# EAGLE design lyte-byte-pcb (EAGLE 7.4.0)
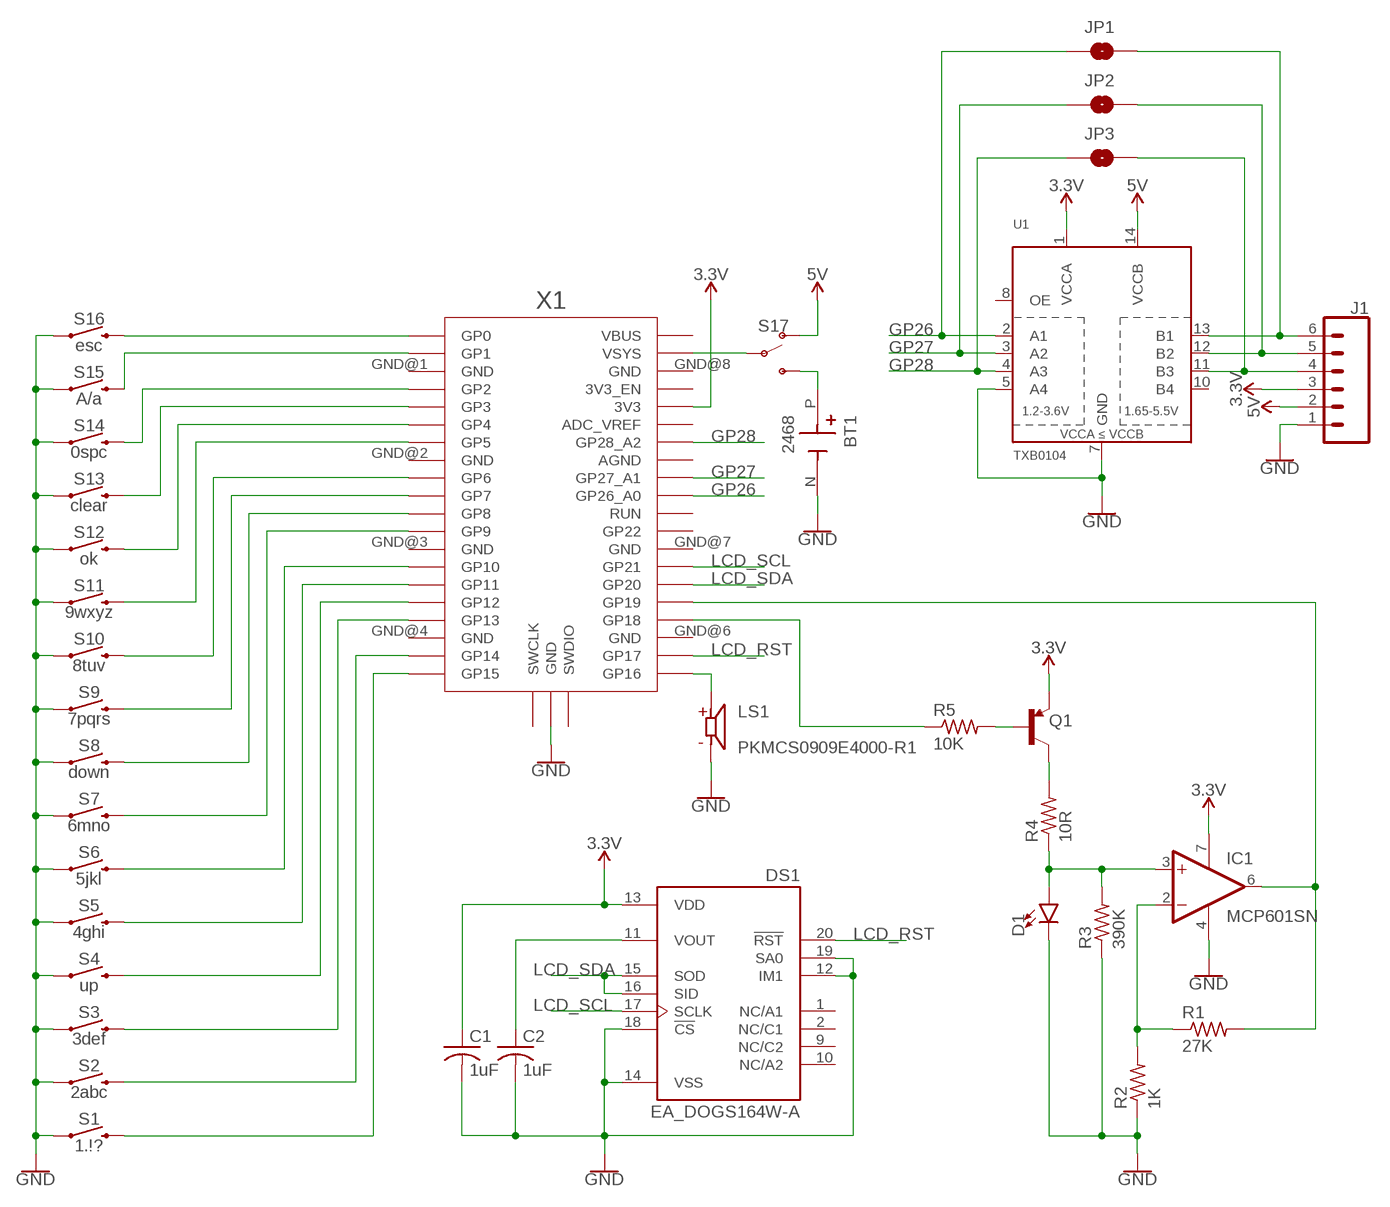
[diagram p0: schematic, sheet 1]

## Parts
BT1  2468  [BAT_2468]
C1  1uF  C-USC1206  [C1206]
C2  1uF  C-USC1206  [C1206]
D1  LED5MM  [LED_5MM]
DS1  EA_DOGS164W-A  [LCD_EA_DOGS164W-A]
IC1  MCP601SN  [SO08]
J1  CONN_06SILK_FEMALE_PTH  [1X06]
JP1  JUMPER-SMT_2_NO_NO-SILK  [SMT-JUMPER_2_NO_NO-SILK]
JP2  JUMPER-SMT_2_NO_NO-SILK  [SMT-JUMPER_2_NO_NO-SILK]
JP3  JUMPER-SMT_2_NO_NO-SILK  [SMT-JUMPER_2_NO_NO-SILK]
LS1  PKMCS0909E4000-R1  [SPKR_PKMCS0909E4000-R1]
Q1  TRANS_PNP-PMBT3906|MMBT3906L  [SOT23-3]
R1  27K  R-US_R1206  [R1206]
R2  1K  R-US_R1206  [R1206]
R3  390K  R-US_R1206  [R1206]
R4  10R  R-US_R1206  [R1206]
R5  10K  R-US_R1206  [R1206]
S1  1.\!?  MOMENTARY-SWITCH-SPST-SMD-5.2MM  [TACTILE_SWITCH_SMD_5.2MM]
S2  2abc  MOMENTARY-SWITCH-SPST-SMD-5.2MM  [TACTILE_SWITCH_SMD_5.2MM]
S3  3def  MOMENTARY-SWITCH-SPST-SMD-5.2MM  [TACTILE_SWITCH_SMD_5.2MM]
S4  up  MOMENTARY-SWITCH-SPST-SMD-5.2MM  [TACTILE_SWITCH_SMD_5.2MM]
S5  4ghi  MOMENTARY-SWITCH-SPST-SMD-5.2MM  [TACTILE_SWITCH_SMD_5.2MM]
S6  5jkl  MOMENTARY-SWITCH-SPST-SMD-5.2MM  [TACTILE_SWITCH_SMD_5.2MM]
S7  6mno  MOMENTARY-SWITCH-SPST-SMD-5.2MM  [TACTILE_SWITCH_SMD_5.2MM]
S8  down  MOMENTARY-SWITCH-SPST-SMD-5.2MM  [TACTILE_SWITCH_SMD_5.2MM]
S9  7pqrs  MOMENTARY-SWITCH-SPST-SMD-5.2MM  [TACTILE_SWITCH_SMD_5.2MM]
S10  8tuv  MOMENTARY-SWITCH-SPST-SMD-5.2MM  [TACTILE_SWITCH_SMD_5.2MM]
S11  9wxyz  MOMENTARY-SWITCH-SPST-SMD-5.2MM  [TACTILE_SWITCH_SMD_5.2MM]
S12  ok  MOMENTARY-SWITCH-SPST-SMD-5.2MM  [TACTILE_SWITCH_SMD_5.2MM]
S13  clear  MOMENTARY-SWITCH-SPST-SMD-5.2MM  [TACTILE_SWITCH_SMD_5.2MM]
S14  0spc  MOMENTARY-SWITCH-SPST-SMD-5.2MM  [TACTILE_SWITCH_SMD_5.2MM]
S15  A/a  MOMENTARY-SWITCH-SPST-SMD-5.2MM  [TACTILE_SWITCH_SMD_5.2MM]
S16  esc  MOMENTARY-SWITCH-SPST-SMD-5.2MM  [TACTILE_SWITCH_SMD_5.2MM]
S17  SWITCH-SPDT-SMD-AYZ0202  [SWITCH_DPDT_SMD_AYZ0202]
U1  TXB0104  TXB0104PWRSOIC14  [SO14]
X1  RPI_PICO_IG-SMD  [RPI_PICO]

## Nets
3.3V: C1.1 DS1.13(VDD) IC1.7(V+) J1.3 Q1.2(E) U1.1(VCCA) X1.3V3
5V: J1.2 S17.1(O) U1.14(VCCB)
GND: BT1.N(NEG) C1.2 C2.2 D1.K(C) DS1.12(IM1) DS1.14(VSS) DS1.18(!CS) DS1.19(SA0) IC1.4(V-) J1.1 LS1.2(N) R2.1 R3.1 S1.1 S2.1 S3.1 S4.1 S5.1 S6.1 S7.1 S8.1 S9.1 S10.1 S11.1 S12.1 S13.1 S14.1 S15.1 S16.1 U1.5(A4) U1.7(GND) X1.GND@5(GND)
GP26: JP1.1 U1.2(A1) X1.GP26_A0
GP27: JP2.1 U1.3(A2) X1.GP27_A1
GP28: JP3.1 U1.4(A3) X1.GP28_A2
LCD_RST: DS1.20(!RST) X1.GP17
LCD_SCL: DS1.17(SCLK) X1.GP21
LCD_SDA: DS1.15(SOD) DS1.16(SID) X1.GP20
LED_TX: IC1.6(OUT) R1.2 X1.GP19
N$1: S16.3 X1.GP0
N$2: S15.3 X1.GP1
N$3: S14.3 X1.GP2
N$4: S13.3 X1.GP3
N$5: S12.3 X1.GP4
N$6: S11.3 X1.GP5
N$7: S10.3 X1.GP6
N$8: S9.3 X1.GP7
N$9: S8.3 X1.GP8
N$10: S7.3 X1.GP9
N$11: S6.3 X1.GP10
N$12: S5.3 X1.GP11
N$13: S4.3 X1.GP12
N$14: S3.3 X1.GP13
N$15: S2.3 X1.GP14
N$16: S1.3 X1.GP15
N$17: C2.1 DS1.11(VOUT)
N$18: Q1.1(B) R5.2
N$19: Q1.3(C) R4.2
N$20: D1.A IC1.3(+IN) R3.2 R4.1
N$21: BT1.P(POS) S17.3(S)
N$22: IC1.2(-IN) R1.1 R2.2
N$23: S17.2(P) X1.VSYS
N$24: R5.1 X1.GP18
N$25: J1.6 JP1.2 U1.13(B1)
N$26: J1.5 JP2.2 U1.12(B2)
N$27: J1.4 JP3.2 U1.11(B3)
N$28: LS1.1(P) X1.GP16
Unconnected: DS1.1(NC/A1) DS1.2(NC/C1) DS1.9(NC/C2) DS1.10(NC/A2) U1.8(OE) U1.10(B4) X1.3V3_EN X1.ADC_VREF X1.AGND X1.GND@1(GND) X1.GND@2(GND) X1.GND@3(GND) X1.GND@4(GND) X1.GND@6(GND) X1.GND@7(GND) X1.GND@8(GND) X1.GP22 X1.RUN X1.SWCLK X1.SWDIO X1.VBUS

## Library data of the parts
BT1 = 2468:2468; MANUFACTURER: Keystone; MAXIMUM_PACKAGE_HEIGHT: 13.25; PARTREV: D; SNAPEDA_PN: 2468; STANDARD: Manufacturer Recommendations
C1 C2 = resistor:C-US: CAPACITOR, American symbol
D1 = SparkFun-LED:LED: LED (Generic) Standard schematic elements and footprints for 5mm, 3mm, 1206, and 0603 sized LEDs. Generic LEDs with no color specified.
DS1 = EA_DOGS164W-A:EA_DOGS164W-A; MANUFACTURER: Display Visions; MAXIMUM_PACKAGE_HEIGHT: 2.6mm; PARTREV: 03.2022; SNAPEDA_PN: DOGS164W-A; STANDARD: IPC-7351B
IC1 = linear:MCP601: Single Op Amp 2.7V to 6.0V Single Supply CMOS Source: http://ww1.microchip.com/downloads/en/DeviceDoc/21314g.pdf
J1 = SparkFun-Connectors:CONN_06: Multi connection point. Often used as Generic Header-pin footprint for 0.1 inch spaced/style header connections On any of the 0.1 inch spaced packages, you can populate with these: Break Away Headers - Straight <https://www.sparkfun.com/products/116> (PRT-00116) Break Away Male Headers - Right Angle <https://www.sparkfun.com/products/553> (PRT-00553) Female Headers <https://www.sparkfun.com/products/115> (PRT-00115) Break Away Headers - Machine Pin <https://www.sparkfun.com/products/117> (PRT-00117) Break Away Female Headers - Swiss Machine Pin <https://www.sparkfun.com/products/743> (PRT-00743) Arduino Stackable Header - 6 Pin <https://www.sparkfun.com/products/9280> (PRT-09280) For SCREWTERMINALS and SPRING TERMINALS visit here: Screw Terimnals on SparkFun.com <https://www.sparkfun.com/search/results?term=Screw+Terminals> (5mm/3.5mm/2.54mm spacing) This device is also useful as a general connection point to wire up your design to another part of your project. Our various solder wires solder well into these plated through hole pads. Hook-Up Wire - Assortment (Stranded, 22 AWG) <https://www.sparkfun.com/products/11375> (PRT-11375) Hook-Up Wire - Assortment (Solid Core, 22 AWG) <https://www.sparkfun.com/products/11367> (PRT-11367) View the entire wire category on our website here <https://www.sparkfun.com/categories/141>; PROD_ID: CONN-08437
JP1-JP3 = SparkFun-Jumpers:JUMPER-SMT_2_NO: Normally open jumper This jumper has two pads in close proximity to each other. Apply solder to close the connection. Round pads are easier to solder for beginners, but are a lot larger. SparkFun Product that uses the round pads: SparkFun EL Sequencer <https://www.sparkfun.com/products/12781>
LS1 = PKMCS0909E4000-R1:PKMCS0909E4000-R1: Buzzers Transducer, Externally Driven Piezo 1.5V 4kHz 65dB @ 1.5V, 10cm Surface Mount Solder Pads; MANUFACTURER: Murata Electronics; MAXIMUM_PACKAGE_HEIGHT: 1.9 mm; PARTREV: May 22, 2020; STANDARD: Manufacturer Recommendations
Q1 = SparkFun-DiscreteSemi:TRANS_PNP: PNP transistor Current controlled devices typically used to amplify current or used as a switch. SparkFun Products: SparkFun Serial Enabled 16x2 LCD - Red on Black <https://www.sparkfun.com/products/9068> SparkFun Logomatic <https://www.sparkfun.com/products/12772>; PROD_ID: TRANS-08052; VALUE: 200mA/40V
R1-R5 = resistor:R-US_: RESISTOR, American symbol
S1-S16 = SparkFun-Switches:MOMENTARY-SWITCH-SPST: Momentary Switch (Pushbutton) - SPST Normally-open (NO) SPST momentary switches (buttons, pushbuttons). Variants PTH-12MM - 12mm square, through-hole Momentary Pushbutton Switch - 12mm Square <https://www.sparkfun.com/products/9190> (COM-09190) PTH-6.0MM, PTH-6.0MM-KIT - 6.0mm square, through-hole Mini Pushbutton Switch <https://www.sparkfun.com/products/97> (COM-00097) KIT package intended for soldering kit's - only one side of pads' copper is exposed. PTH-RIGHT-ANGLE-KIT - Right-angle, through-hole Right Angle Tactile Button <https://www.sparkfun.com/products/10791> - Used on SparkFun BigTime Watch Kit <https://www.sparkfun.com/products/11734> SMD-12MM - 12mm square, surface-mount Tactile Button - SMD (12mm) <https://www.sparkfun.com/products/12993> (COM-12993) Used on SparkFun PicoBoard <https://www.sparkfun.com/products/11888> SMD-4.5MM - 4.5mm Square Trackball Switch Used on SparkFun Blackberry Trackballer Breakout <https://www.sparkfun.com/products/13169> SMD-4.6MMX2.8MM - 4.60mm x 2.80mm, surface mount Used on SparkFun SAMD21 Mini Breakout <https://www.sparkfun.com/products/13664> SMD-5.2MM, SMD-5.2-REDUNDANT - 5.2mm square, surface-mount Mini Pushbutton Switch - SMD <https://www.sparkfun.com/products/8720> (COM-08720) Used on Arduino Pro Mini <https://www.sparkfun.com/products/11114> REDUNDANT package connects both switch circuits together SMD-6.0X3.5MM - 6.0 x 3.5mm, surface mount Momentary Reset Switch SMD <https://www.sparkfun.com/products/8229> (COM-08229) SMD-6.2MM-TALL - 6.2mm square, surface mount Tactile Button - SMD (6mm) <https://www.sparkfun.com/products/12992> Used on SparkFun Digital Sandbox <https://www.sparkfun.com/products/12651> SMD-RIGHT-ANGLE - Right-angle, surface mount Used on SparkFun Block for Intel® Edison - Arduino <https://www.sparkfun.com/products/13036>; PROD_ID: SWCH-08247; SF_SKU: COM-08720
S17 = SparkFun-Switches:SWITCH-SPDT: Single Pole, Double Throw (SPDT) Switch Single-pole, double-throw (SPDT) switch. Variant Overview SMD-AYZ0202 Surface Mount DPDT Switch <https://www.sparkfun.com/products/597> (COM-00597) Used on e.g. LilyPad Arduino USB - ATmega32U4 Board <https://www.sparkfun.com/products/12049> PTH-11.6X4.0MM SPDT Mini Power Switch <https://www.sparkfun.com/products/102> (COM-00102) Used on e.g. SparkFun Simon Says - Through-Hole Soldering Kit <https://www.sparkfun.com/products/10547> (KIT-10547) PTH-11.6X4.0MM-KIT KIT version of SPDT Mini Power Switch - Simplifies soldering by removing tStop of switch pins - only one side can be soldered. PTH-11.6X4.0MM-LOCK LOCK version of SPDT Mini Power Switch - Offset pins hold switch in place for easier soldering. SMD-RIGHT-ANGLE Surface Mount Right Angle Switch <https://www.sparkfun.com/products/10860> (COM-10860) Used on e.g. SparkFun ESP8266 Thing <https://www.sparkfun.com/products/13231>; PROD_ID: SWCH-08179; SF_ID: COM-00597
U1 = SparkFun-IC-Comms:TXB0104PWR: 4-Bit Bi-Directional Level Shifter 1.2V-3.6V (VCCA) to 1.65V-5.5V (VCCB) bi-directional level shifter with auto direction sensing. Max data rate - VCCA 1.8V: 20Mbps (50ns), VCCA 3.3V: 100Mbps (10ns) Digikey: 296-21929-1-ND (TSSOP) Datasheet <http://cdn.sparkfun.com/datasheets/BreakoutBoards/txb0104.pdf> SparkFun Products SparkFun Cellular Shield - MG2639 <https://www.sparkfun.com/products/13120> (CEL-13120) SparkFun Level Shifting microSD Breakout <https://www.sparkfun.com/products/13743> (DEV-13743) SparkFun Voltage-Level Translator Breakout - TXB0104 <https://www.sparkfun.com/products/11771> (BOB-11771) SparkFun Block for Intel® Edison - UART <https://www.sparkfun.com/products/13040> (DEV-13040) SparkFun Block for Intel® Edison - Arduino <https://www.sparkfun.com/products/13036> (DEV-13036); PROD_ID: IC-11329
X1 = RaspberryPi_Pico:RPI_PICO_IG

## Board
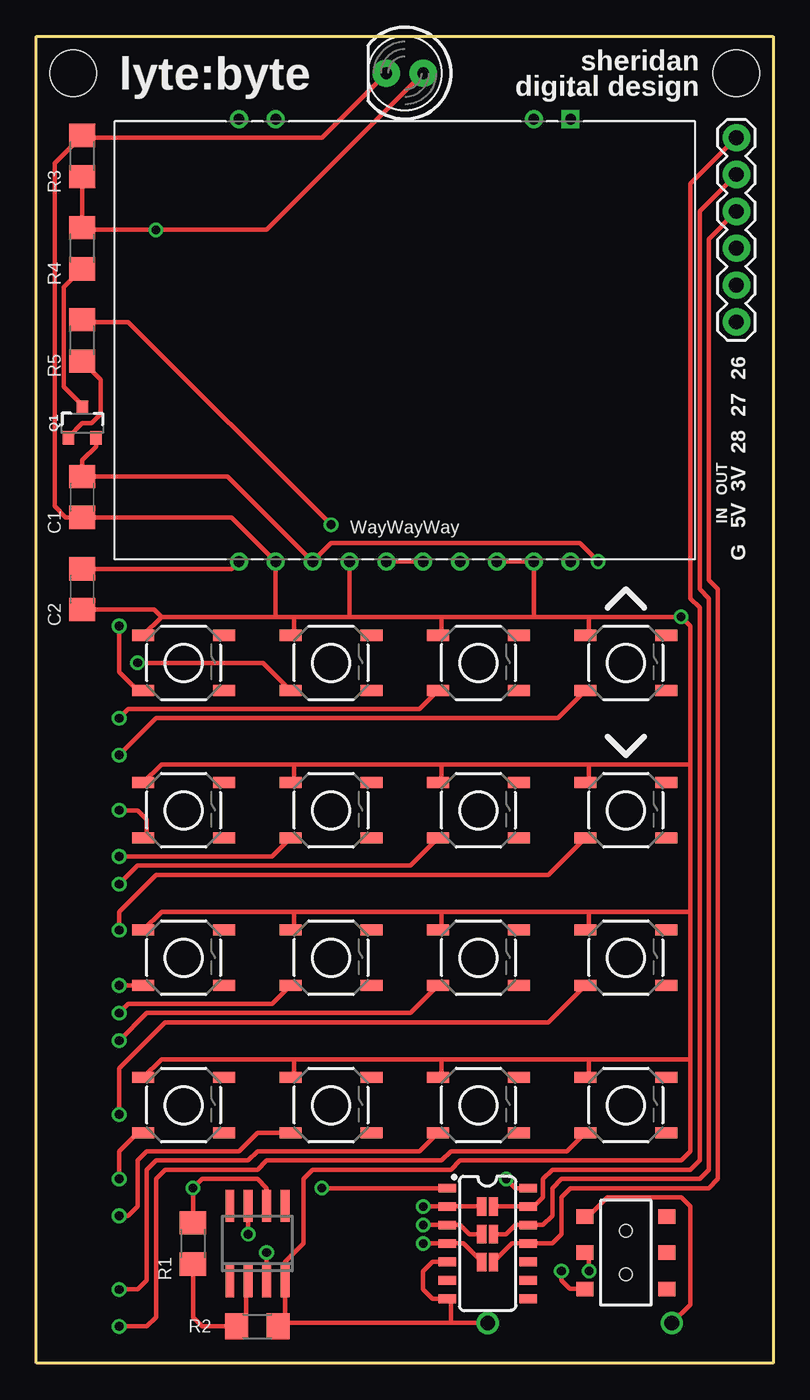
[diagram p1: board, top side]
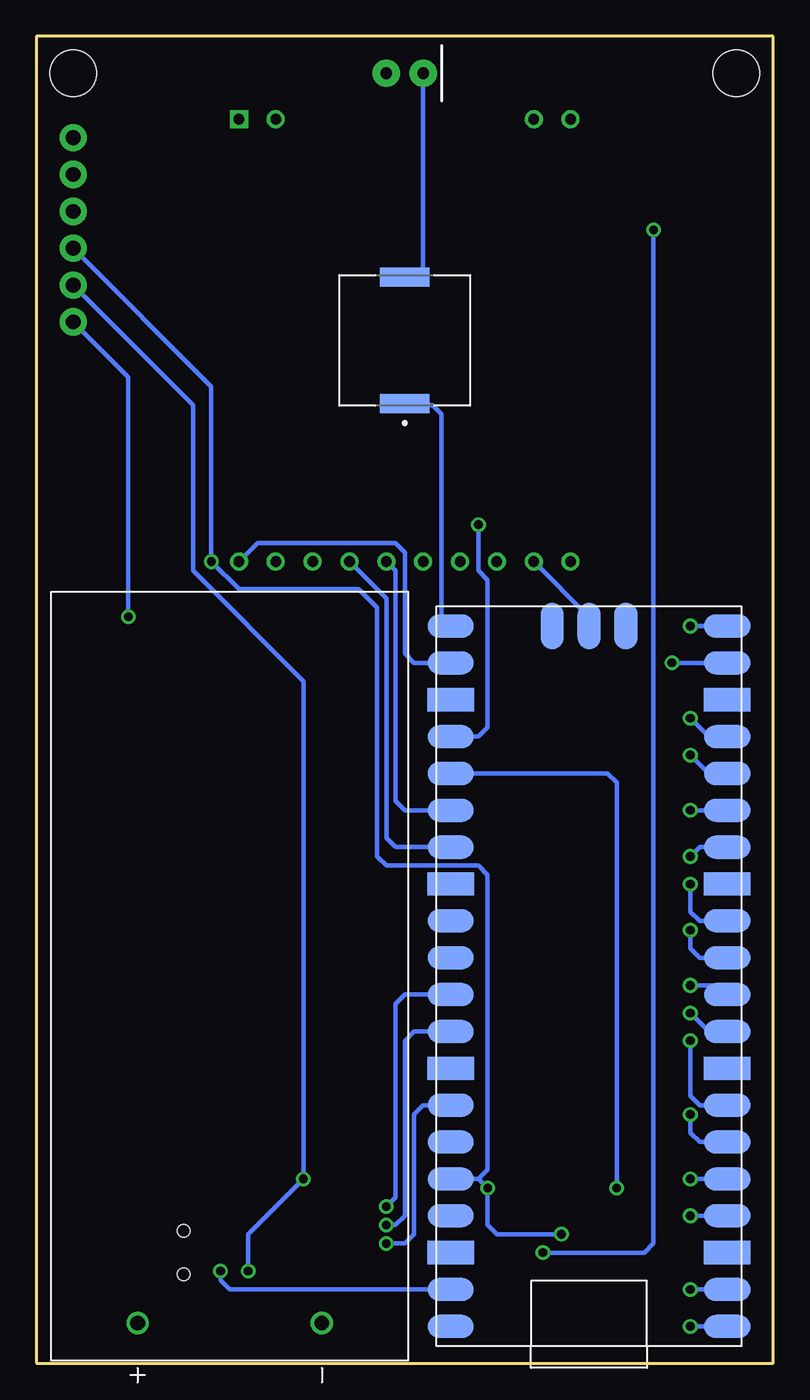
[diagram p2: board, bottom side, seen from below]

Size 50.8 x 91.44 mm. Coordinates in mm from the lower left corner, seen from the top.
Outline: 0,0 0,91.44 50.8,91.44 50.8,0 0,0
Copper layers (1*16): Top 0.035mm / dielectric 1.5mm / Bottom 0.035mm
Design rules "default": minimum track width 10mil, minimum drill 24mil, track to track 8mil, track to pad 8mil, pad to pad 8mil, via to via 8mil, smd to smd 8mil, copper to edge 40mil, drill to drill 8mil, minimum pad ring 10mil, minimum via ring 8mil, stop-mask expansion 4mil, vias tented up to drill 0mil, thermal gap 10mil
Holes 3.2 mm at 2.54,88.9 48.26,88.9

### Footprints (pad centres in the part's own frame; a part is rotated, then mirrored left to right if it is on the bottom)
BAT_2468 = drill 1.02: N 23.9,6.35; P 23.9,-6.35
C1206 = smd 1.6 x 1.8: 1 -1.4,0; 2 1.4,0
LED_5MM = drill 0.813 pad 1.88: A -1.27,0; K 1.27,0
LCD_EA_DOGS164W-A = drill 0.73 pad 1.13 square: 1 -15.24,11.43 | drill 0.73 pad 1.13: 2 -15.24,8.89; 9 -15.24,-8.89; 10 -15.24,-11.43; 11 15.24,-11.43; 12 15.24,-8.89; 13 15.24,-6.35; 14 15.24,-3.81; 15 15.24,-1.27; 16 15.24,1.27; 17 15.24,3.81; 18 15.24,6.35; 19 15.24,8.89; 20 15.24,11.43
SO08 = smd 0.6 x 2.2: 1 -1.905,-2.6; 2 -0.635,-2.6; 3 0.635,-2.6; 4 1.905,-2.6; 5 1.905,2.6; 6 0.635,2.6; 7 -0.635,2.6; 8 -1.905,2.6
1X06 = drill 1.016 pad 1.88: 1 0,0; 2 2.54,0; 3 5.08,0; 4 7.62,0; 5 10.16,0; 6 12.7,0
SMT-JUMPER_2_NO_NO-SILK = smd 0.635 x 1.27: 1 -0.406,0; 2 0.406,0
SPKR_PKMCS0909E4000-R1 = smd 1.3 x 3.4: 1 -4.35,0; 2 4.35,0
SOT23-3 = smd 0.8 x 0.9: 1 -0.95,-1; 2 0.95,-1; 3 0,1.1
R1206 = smd 1.6 x 1.803: 1 -1.422,0; 2 1.422,0
TACTILE_SWITCH_SMD_5.2MM = smd 1.524 x 0.762: 1 -2.794,1.905; 2 2.794,1.905; 3 -2.794,-1.905; 4 2.794,-1.905
SWITCH_DPDT_SMD_AYZ0202 = smd 1 x 1.15: 1 -2.5,2.825; 2 0,2.825; 3 2.5,2.825; 4 -2.5,-2.825; 5 0,-2.825; 6 2.5,-2.825 | hole 0.85: 1.5,0; -1.5,0
SO14 = smd 0.6 x 1.2: 1 -3.81,-2.8; 2 -2.54,-2.8; 3 -1.27,-2.8; 4 0,-2.8; 5 1.27,-2.8; 6 2.54,-2.8; 7 3.81,-2.8; 8 3.81,2.8; 9 2.54,2.8; 10 1.27,2.8; 11 0,2.8; 12 -1.27,2.8; 13 -2.54,2.8; 14 -3.81,2.8
RPI_PICO = smd 3.2 x 1.6: 3V3 9.525,13.97; 3V3_EN 9.525,16.51; ADC_VREF 9.525,11.43; AGND 9.525,6.35; GND@1 -9.525,19.05; GND@2 -9.525,6.35; GND@3 -9.525,-6.35; GND@4 -9.525,-19.05; GND@6 9.525,-19.05; GND@7 9.525,-6.35; GND@8 9.525,19.05; GP0 -9.525,24.13; GP1 -9.525,21.59; GP2 -9.525,16.51; GP3 -9.525,13.97; GP4 -9.525,11.43; GP5 -9.525,8.89; GP6 -9.525,3.81; GP7 -9.525,1.27; GP8 -9.525,-1.27; GP9 -9.525,-3.81; GP10 -9.525,-8.89; GP11 -9.525,-11.43; GP12 -9.525,-13.97; GP13 -9.525,-16.51; GP14 -9.525,-21.59; GP15 -9.525,-24.13; GP16 9.525,-24.13; GP17 9.525,-21.59; GP18 9.525,-16.51; GP19 9.525,-13.97; GP20 9.525,-11.43; GP21 9.525,-8.89; GP22 9.525,-3.81; GP26_A0 9.525,1.27; GP27_A1 9.525,3.81; GP28_A2 9.525,8.89; RUN 9.525,-1.27; VBUS 9.525,24.13; VSYS 9.525,21.59 | smd 1.6 x 3.2: GND@5 0,-24.13; SWCLK -2.54,-24.13; SWDIO 2.54,-24.13

### Placement (x,y rotation side)
BT1  37.47,26.67 270 bottom
C1  3.17,59.69 270 top
C2  3.17,53.34 270 top
D1  25.4,88.9 180 top
DS1  25.4,70.48 270 top
IC1  15.24,8.26 0 top
J1  48.26,71.75 90 top
JP1  31.11,10.79 0 top
JP2  31.11,8.89 0 top
JP3  31.11,6.99 0 top
LS1  25.4,70.48 90 bottom
Q1  3.17,64.77 0 top
R1  10.79,8.26 90 top
R2  15.24,2.54 180 top
R3  3.17,83.19 270 top
R4  3.17,76.83 270 top
R5  3.17,70.48 270 top
S1  10.16,48.26 0 top
S2  20.32,48.26 0 top
S3  30.48,48.26 0 top
S4  40.64,48.26 0 top
S5  10.16,38.1 0 top
S6  20.32,38.1 0 top
S7  30.48,38.1 0 top
S8  40.64,38.1 0 top
S9  10.16,27.94 0 top
S10  20.32,27.94 0 top
S11  30.48,27.94 0 top
S12  40.64,27.94 0 top
S13  10.16,17.78 0 top
S14  20.32,17.78 0 top
S15  30.48,17.78 0 top
S16  40.64,17.78 0 top
S17  40.64,7.62 90 top
U1  31.11,8.26 270 top
X1  12.7,26.67 180 bottom

### Tracks (layer width: path | path; a pad name or v marks a point on that pad's centre or on a via)
3.3V  (via drill 0.6)
  Top 0.305: Q1.2 4.12,63.18 3.17,62.23 C1.1 13.21,61.09 DS1.13 20.32,56.52 37.47,56.52 v38.73,55.24 | IC1.7 v14.61,8.89 | v19.68,12.06 U1.1
  Bottom 0.305: v14.61,8.89 19.05,8.89 19.68,9.53 v19.68,12.06 20.32,12.7 | 20.32,12.7 X1.3V3 | 20.32,12.7 19.68,13.34 19.68,33.66 20.32,34.29 26.67,34.29 27.3,34.92 27.3,52.07 28.57,53.34 36.83,53.34 v38.73,55.24 38.73,67.31 J1.3
5V  (via drill 0.6)
  Top 0.305: U1.14 33.02,12.06 v32.38,12.7 | S17.1 36.79,5.12 36.2,5.71 v36.2,6.35
  Bottom 0.305: J1.2 40.01,66.04 40.01,54.61 32.38,46.99 v32.38,12.7 36.2,8.89 v36.2,6.35
GND  (via drill 0.6)
  Top 0.305: S4.1 38.1,50.16 38.1,51.44 | 38.1,51.44 34.29,51.44 | 34.29,51.44 27.94,51.44 | 27.94,51.44 21.59,51.44 | 21.59,51.44 17.78,51.44 | 17.78,51.44 16.51,51.44 | S2.1 17.78,50.16 17.78,51.44 | S3.1 27.94,50.16 27.94,51.44 | S8.1 38.1,40.01 38.1,41.27 | 38.1,41.27 27.94,41.27 | 27.94,41.27 17.78,41.27 | S6.1 17.78,40.01 17.78,41.27 | S7.1 27.94,40.01 27.94,41.27 | S12.1 38.1,29.84 38.1,31.11 | 38.1,31.11 27.94,31.11 | 27.94,31.11 17.78,31.11 | S10.1 17.78,29.84 17.78,31.11 | S11.1 27.94,29.84 27.94,31.11 | S16.1 38.1,19.68 38.1,20.95 | 38.1,20.95 27.94,20.95 | 27.94,20.95 17.78,20.95 | S14.1 17.78,19.68 17.78,20.95 | S15.1 27.94,19.68 27.94,20.95 | 16.51,51.44 DS1.12 13.46,58.29 C1.2 2.04,58.29 1.27,59.05 1.27,82.7 3.02,84.45 | 38.1,20.95 45.09,20.95 | 45.09,20.95 45.09,31.11 | 45.09,31.11 45.09,41.27 | 38.1,41.27 45.09,41.27 | 38.1,31.11 45.09,31.11 | 17.78,20.95 8.64,20.95 S13.1 | 17.78,31.11 8.64,31.11 S9.1 | 17.78,41.27 8.64,41.27 S5.1 | 16.51,51.44 8.64,51.44 | 8.64,51.44 S1.1 | 34.29,51.44 DS1.19 DS1.18 | C2.2 8.13,51.94 8.64,51.44 | 3.02,84.45 R3.1 | DS1.14 21.59,51.44 | 38.1,51.44 v44.45,51.44 45.09,50.8 45.09,41.27 | 17.14,3.02 IC1.4 17.14,6.99 18.41,8.26 18.41,12.7 19.05,13.34 28.57,13.34 29.21,13.97 44.45,13.97 45.09,14.61 45.09,20.95 | 17.14,3.02 R2.1 | D1.K 19.68,84.45 3.02,84.45 | BT1.N 28.57,2.77 | 28.57,2.77 17.4,2.77 17.14,3.02 | 28.57,6.99 U1.5 27.3,6.99 26.67,6.35 26.67,5.08 27.3,4.45 U1.7 28.57,4.45 28.57,2.77
  Bottom 0.305: DS1.12 12.7,51.44 X1.GND@5 | v44.45,51.44 44.45,67.94 J1.1 | LS1.2 24.23,74.83 24.13,74.93 D1.K
GP26  (via drill 0.6)
  Top 0.305: JP1.1 U1.2 v26.67,10.79
  Bottom 0.305: X1.GP26_A0 25.4,25.4 26.04,24.77 26.04,11.43 v26.67,10.79
GP27  (via drill 0.6)
  Top 0.305: JP2.1 29.84,8.89 29.21,9.53 U1.3 v26.67,9.53
  Bottom 0.305: X1.GP27_A1 24.77,22.86 25.4,22.23 25.4,10.16 26.04,9.53 v26.67,9.53
GP28  (via drill 0.6)
  Top 0.305: v26.67,8.26 U1.4 29.44,8.26 JP3.1
  Bottom 0.305: X1.GP28_A2 24.13,17.78 24.77,17.14 24.77,8.89 25.4,8.26 v26.67,8.26
LCD_RST
  Bottom 0.305: DS1.20 35.56,56.52 26.04,56.52 25.4,55.88 25.4,48.9 24.77,48.26 X1.GP17
LCD_SCL
  Bottom 0.305: X1.GP21 26.04,35.56 26.67,36.2 26.67,52.7 DS1.17
LCD_SDA
  Top 0.305: DS1.16 DS1.15
  Bottom 0.305: X1.GP20 25.4,38.1 26.04,38.73 26.04,54.61 DS1.16
LED_TX  (via drill 0.6)
  Top 0.305: R1.2 v10.79,12.06 11.43,12.7 15.24,12.7 15.88,12.06 IC1.6
  Bottom 0.305: X1.GP19 11.43,40.64 10.79,40.01 v10.79,12.06
N$1  (via drill 0.6)
  Top 0.305: v5.71,2.54 7.62,2.54 8.26,3.17 8.26,12.7 8.89,13.34 15.24,13.34 15.88,13.97 27.94,13.97 28.57,14.61 36.58,14.61 S16.3
  Bottom 0.305: X1.GP0 v5.71,2.54
N$2  (via drill 0.6)
  Top 0.305: v5.71,5.08 6.99,5.08 7.62,5.71 7.62,13.34 8.26,13.97 14.61,13.97 15.24,14.61 26.42,14.61 S15.3
  Bottom 0.305: X1.GP1 v5.71,5.08
N$3  (via drill 0.6)
  Top 0.305: 17.14,15.88 S14.3 15.24,15.88 13.97,14.61 7.62,14.61 6.99,13.97 6.99,10.79 6.35,10.16 v5.71,10.16
  Bottom 0.305: X1.GP2 v5.71,10.16
N$4  (via drill 0.6)
  Top 0.305: S13.3 6.99,15.88 5.71,14.61 v5.71,12.7
  Bottom 0.305: X1.GP3 v5.71,12.7
N$5  (via drill 0.6)
  Top 0.305: v5.71,17.14 5.71,20.32 8.89,23.5 35.31,23.5 S12.3 37.85,25.78
  Bottom 0.305: X1.GP4 5.08,15.24 5.71,15.88 v5.71,17.14
N$6  (via drill 0.6)
  Top 0.305: v5.71,22.23 7.62,24.13 25.78,24.13 S11.3
  Bottom 0.305: X1.GP5 5.08,17.78 5.71,18.41 v5.71,22.23
N$7  (via drill 0.6)
  Top 0.305: 17.78,26.04 S10.3 16.26,24.77 6.35,24.77 v5.71,24.13
  Bottom 0.305: v5.71,24.13 4.45,22.86 X1.GP6
N$8  (via drill 0.6)
  Top 0.305: S9.3 v5.71,26.04
  Bottom 0.305: v5.71,26.04 3.17,26.04 X1.GP7
N$9  (via drill 0.6)
  Top 0.305: v5.71,29.84 5.71,31.11 8.26,33.66 35.31,33.66 S8.3
  Bottom 0.305: X1.GP8 5.08,27.94 5.71,28.57 v5.71,29.84
N$10  (via drill 0.6)
  Top 0.305: v5.71,33.02 6.99,34.29 25.78,34.29 S7.3
  Bottom 0.305: X1.GP9 5.08,30.48 5.71,31.11 v5.71,33.02
N$11  (via drill 0.6)
  Top 0.305: v5.71,34.92 16.26,34.92 S6.3
  Bottom 0.305: X1.GP10 5.08,35.56 v5.71,34.92
N$12  (via drill 0.6)
  Top 0.305: v5.71,38.1 6.99,38.1 7.62,37.47 7.62,36.45 S5.3
  Bottom 0.305: X1.GP11 v5.71,38.1
N$13  (via drill 0.6)
  Top 0.305: v5.71,41.91 8.26,44.45 35.94,44.45 S4.3
  Bottom 0.305: X1.GP12 4.45,40.64 v5.71,41.91
N$14  (via drill 0.6)
  Top 0.305: v5.71,44.45 6.35,45.09 26.42,45.09 S3.3
  Bottom 0.305: X1.GP13 4.45,43.18 v5.71,44.45
N$15  (via drill 0.6)
  Top 0.305: v6.99,48.26 15.62,48.26 S2.3
  Bottom 0.305: X1.GP14 v6.99,48.26
N$16  (via drill 0.6)
  Top 0.305: S1.3 6.99,46.35 5.71,47.62 v5.71,50.8
  Bottom 0.305: 4.45,50.8 X1.GP15 v5.71,50.8
N$17
  Top 0.305: C2.1 13.46,54.74 DS1.11
N$18
  Top 0.305: Q1.1 2.23,63.82 3.17,64.77 3.81,64.77 4.45,65.41 4.45,67.79 R5.2
N$19
  Top 0.305: Q1.3 3.17,66.04 1.91,67.31 1.91,74.14 R4.2
N$20  (via drill 0.6)
  Top 0.305: R3.2 R4.1 3.33,78.11 v8.26,78.11 15.88,78.11 D1.A | IC1.3 v15.88,7.62
  Bottom 0.305: v15.88,7.62 8.89,7.62 8.26,8.26 v8.26,78.11
N$21
  Top 0.305: S17.3 38.06,10.12 39.37,11.43 44.45,11.43 45.09,10.79 45.09,4.04 BT1.P
N$22
  Top 0.305: IC1.2 14.45,5.5 14.45,3.17 R2.2 11.43,2.54 10.79,3.17 R1.1
N$23  (via drill 0.6)
  Top 0.305: v38.1,6.35 38.1,7.33 S17.2
  Bottom 0.305: v38.1,6.35 38.1,5.71 37.47,5.08 X1.VSYS
N$24  (via drill 0.6)
  Top 0.305: v20.32,57.78 6.35,71.75 3.33,71.75 R5.1
  Bottom 0.305: X1.GP18 20.32,43.18 19.68,43.81 19.68,53.98 20.32,54.61 v20.32,57.78
N$25
  Top 0.305: JP1.2 U1.13 34.29,10.79 34.92,11.43 34.92,12.7 35.56,13.34 45.09,13.34 45.72,13.97 45.72,52.07 45.09,52.7 45.09,81.28 J1.6
N$26
  Top 0.305: JP2.2 32.38,8.89 33.02,9.53 U1.12 34.92,9.53 35.56,10.16 35.56,12.06 36.2,12.7 45.72,12.7 46.35,13.34 46.35,52.7 45.72,53.34 45.72,79.38 J1.5
N$27
  Top 0.305: J1.4 46.35,77.47 46.35,53.98 46.99,53.34 46.99,12.7 46.35,12.06 36.83,12.06 36.2,11.43 36.2,8.89 35.56,8.26 U1.11 32.79,8.26 JP3.2
N$28
  Bottom 0.305: X1.GP16 22.86,50.8 22.86,65.41 23.5,66.04 25.3,66.04 LS1.1

### Text on the board
tPlace: lyte:byte | sheridan / digital design | 26 | 27 | 28 | OUT | 3V | IN | 5V | WayWayWay | G